# Altium schematic sheet hall sensor Blogdiagram.SchDoc
size A
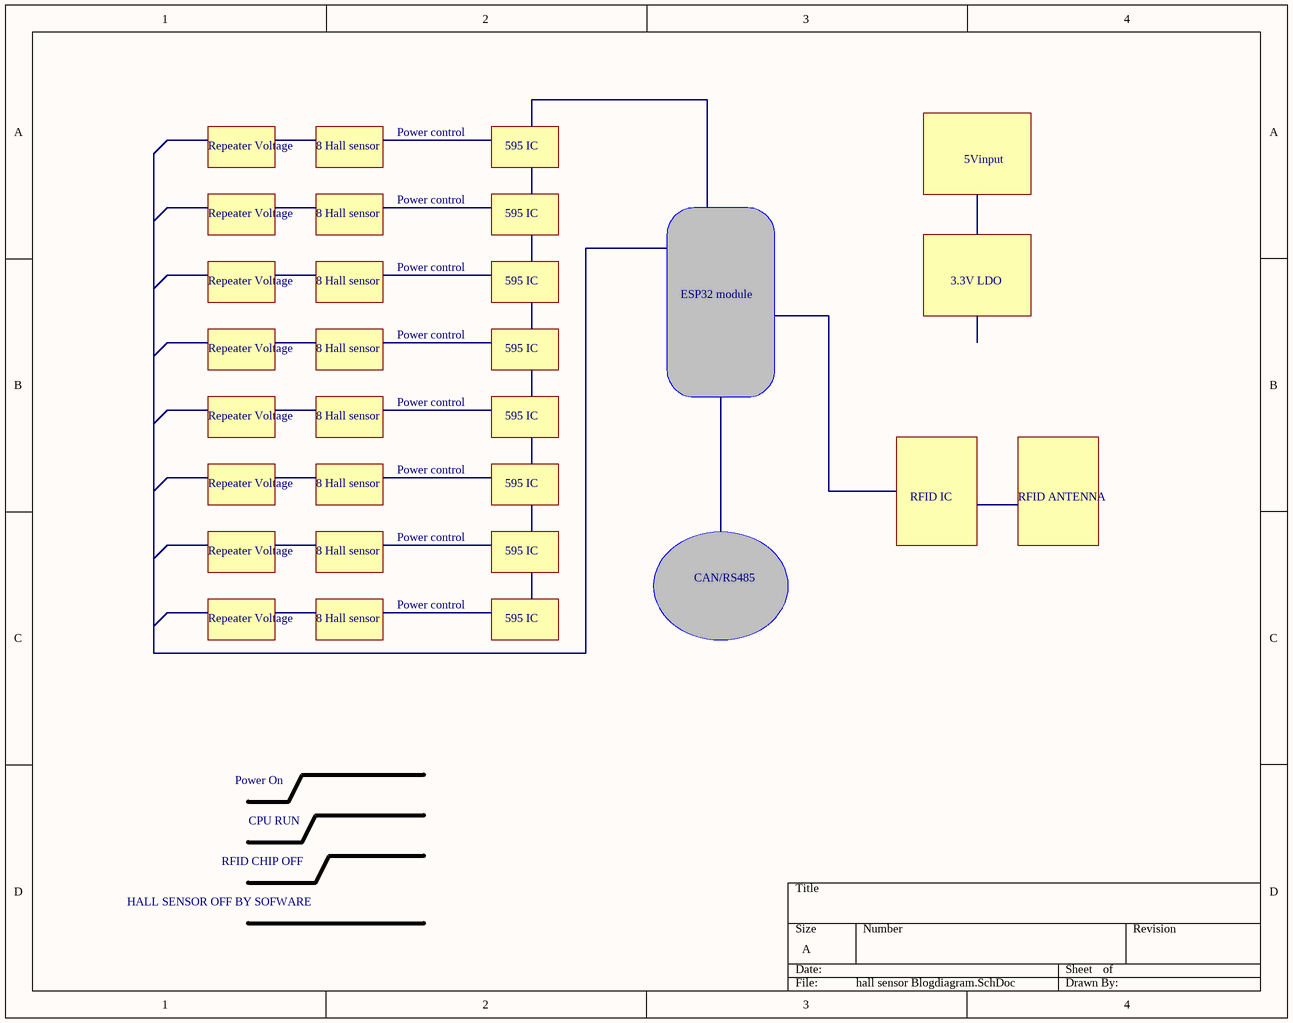
[diagram p0: hall sensor Blogdiagram.SchDoc]

## Notes on the sheet
- Repeater Voltage
- 8 Hall sensor
- Power control
- 595 IC
- 5Vinput
- ESP32 module
- 3.3V LDO
- RFID IC
- RFID ANTENNA
- CAN/RS485
- Power On
- CPU RUN
- HALL SENSOR OFF BY SOFWARE
- RFID CHIP OFF